# EAGLE design sparkfun-battery-babysitter (EAGLE 7.7.0)
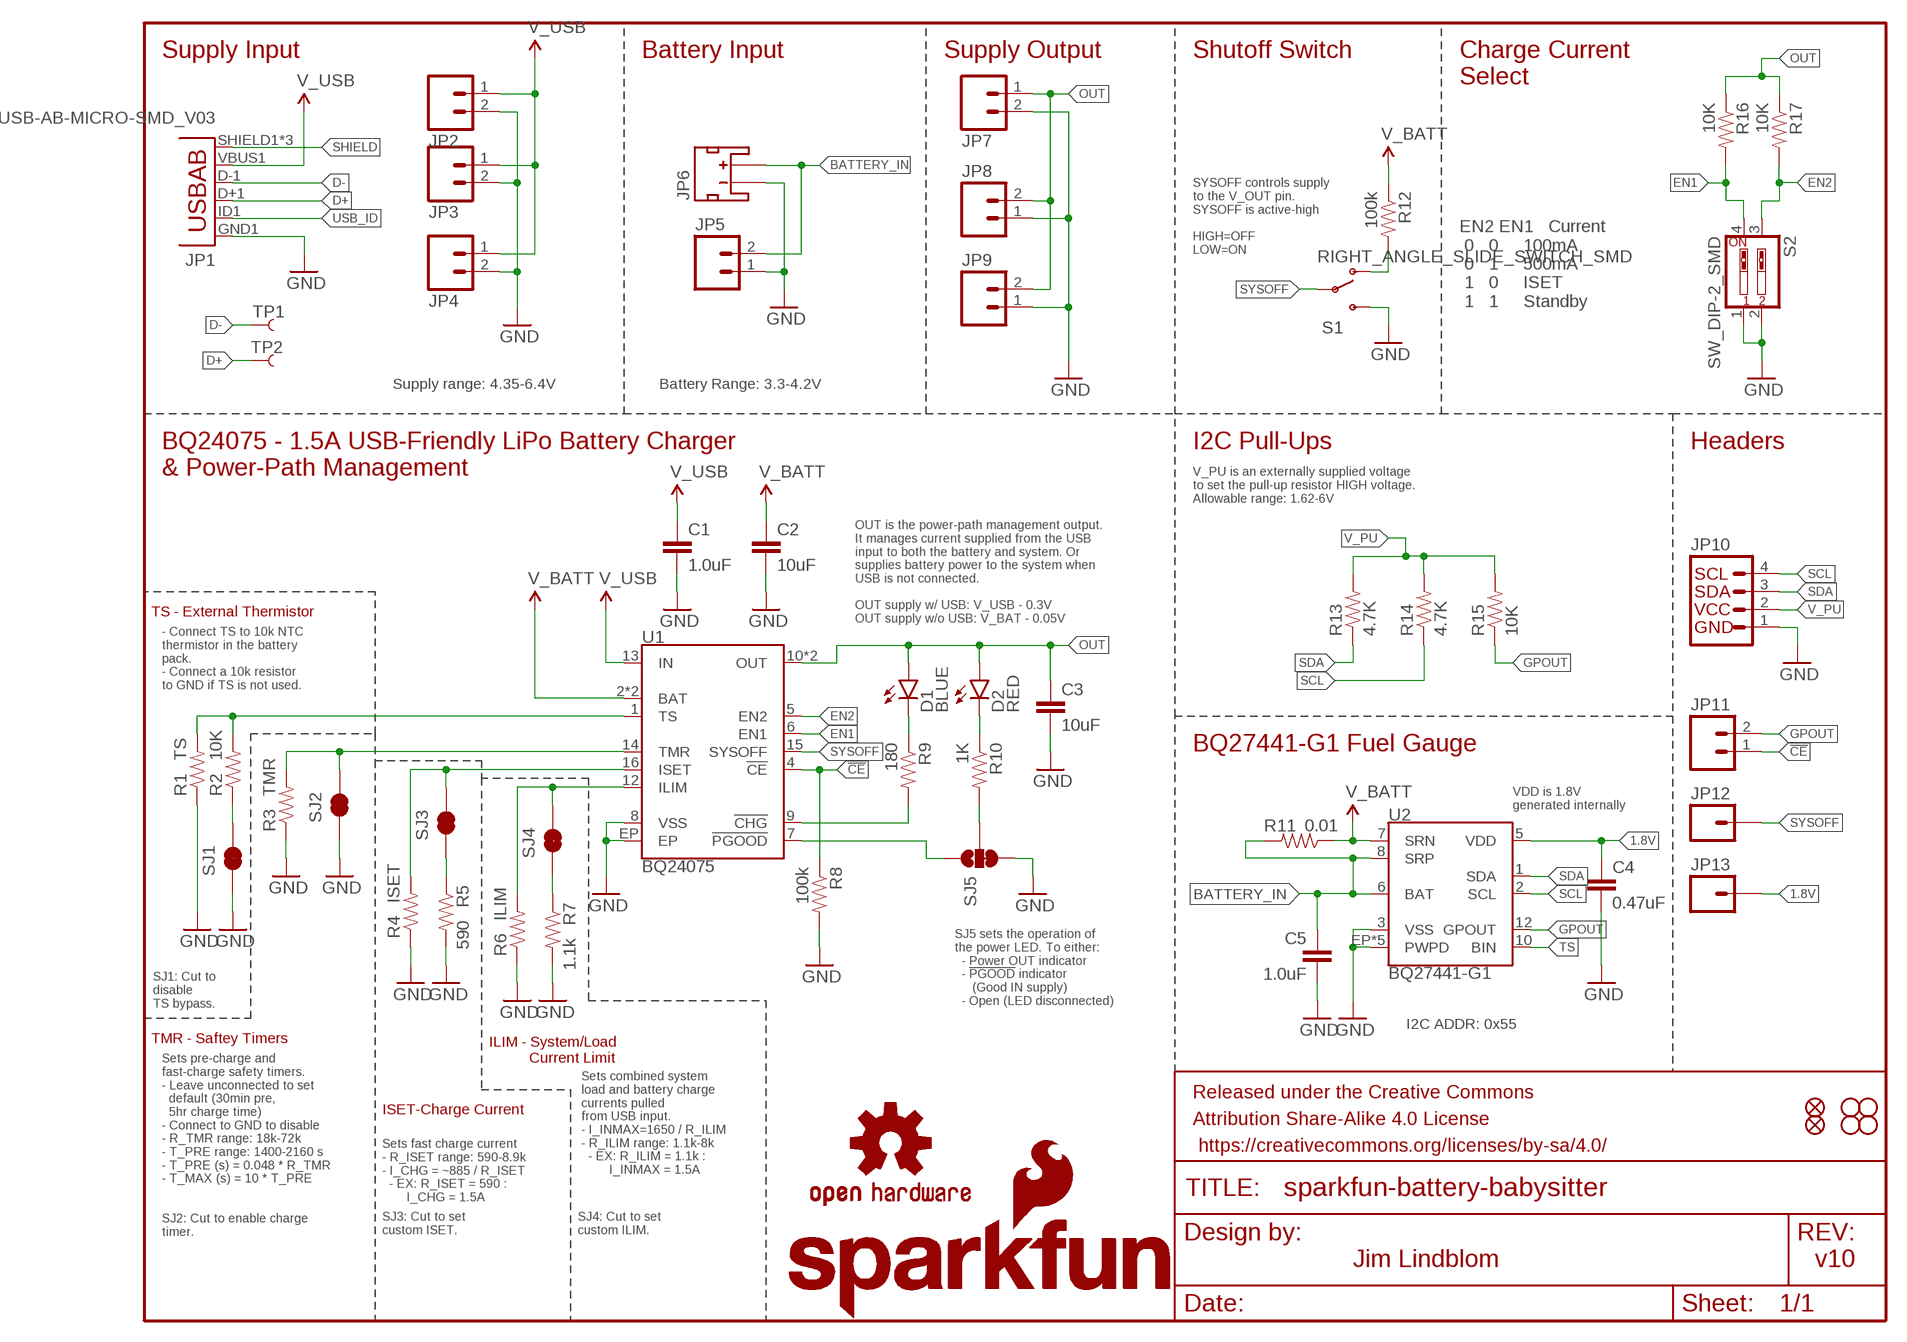
[diagram p0: schematic, sheet 1]

## Parts
C1  1.0uF  1.0UF50V10%(1206)  [1206-CAP]
C2  10uF  10UF10V10%(0805)  [0805-CAP]
C3  10uF  10UF10V10%(0805)  [0805-CAP]
C4  0.47uF  CAP0603-CAP  [0603-CAP]
C5  1.0uF  1.0UF-16V-10%(0603)  [0603-CAP]
D1  BLUE  LED-BLUE0603  [LED-0603]
D2  RED  LED-RED0603  [LED-0603]
FID1  FIDUCIAL1X2  [FIDUCIAL-1X2]
FID2  FIDUCIAL1X2  [FIDUCIAL-1X2]
FRAME1  FRAME-LETTER  [CREATIVE_COMMONS]
JP1  USB-AB-MICRO-SMD_V03  USB-ABCONN-11794  [USB-AB-MICRO-SMD_V03]
JP2  M021X02_NO_SILK  [1X02_NO_SILK]
JP3  M023.5MM-NO_SILK  [SCREWTERMINAL-3.5MM-2-NS]
JP4  M021X02_NO_SILK  [1X02_NO_SILK]
JP5  M021X02_NO_SILK  [1X02_NO_SILK]
JP6  JST_2MM_MALE  [JST-2-SMD]
JP7  M023.5MM-NO_SILK  [SCREWTERMINAL-3.5MM-2-NS]
JP8  M021X02_NO_SILK  [1X02_NO_SILK]
JP9  M02-JST-2-PTH-NO_SILK  [JST-2-PTH-NS]
JP10  I2C_STANDARD_NO_SILK  [1X04_NO_SILK]
JP11  M021X02_NO_SILK  [1X02_NO_SILK]
JP12  M01PTH_NO_SILK_YES_STOP  [1X01_NO_SILK]
JP13  M01PTH_NO_SILK_YES_STOP  [1X01_NO_SILK]
LOGO1  SFE_LOGO_NAME.1_INCH  [SFE_LOGO_NAME_.1]
LOGO2  SFE_LOGO_NAME_FLAME.1_INCH  [SFE_LOGO_NAME_FLAME_.1]
LOGO3  OSHW-LOGOS  [OSHW-LOGO-S]
R1  TS  RESISTORPTH-1/6W  [1/6W-RES]
R2  10K  10KOHM-1/10W-1%(0603)0603  [0603-RES]
R3  TMR  RESISTORPTH-1/6W  [1/6W-RES]
R4  ISET  RESISTORPTH-1/6W  [1/6W-RES]
R5  590  RESISTOR0603-RES  [0603-RES]
R6  ILIM  RESISTORPTH-1/6W  [1/6W-RES]
R7  1.1k  RESISTOR0603-RES  [0603-RES]
R8  100k  100KOHM-1/10W-1%(0603)  [0603-RES]
R9  180  180OHM1/10W1%(0603)  [0603-RES]
R10  1K  1KOHM-1/10W-1%(0603)  [0603-RES]
R11  0.01  RESISTOR1206  [1206]
R12  100k  100KOHM-1/10W-1%(0603)  [0603-RES]
R13  4.7K  4.7KOHM-1/10W-1%(0603)  [0603-RES]
R14  4.7K  4.7KOHM-1/10W-1%(0603)  [0603-RES]
R15  10K  10KOHM-1/10W-1%(0603)0603  [0603-RES]
R16  10K  10KOHM-1/10W-1%(0603)0603  [0603-RES]
R17  10K  10KOHM-1/10W-1%(0603)0603  [0603-RES]
S1  RIGHT_ANGLE_SLIDE_SWITCH_SMD  SWITCH-SPDT-SMD-A  [SWITCH-SPST-SMD-A]
S2  SW_DIP-2_SMD  SW_DIP-2-SMT-HALFSIZE  [DIPSWITCH-02-50MIL]
SJ1  JUMPER-PAD-2-NC_BY_TRACE  [PAD-JUMPER-2-NC_BY_TRACE_YES_SILK]
SJ2  JUMPER-PAD-2-NC_BY_TRACE  [PAD-JUMPER-2-NC_BY_TRACE_YES_SILK]
SJ3  JUMPER-PAD-2-NC_BY_TRACE  [PAD-JUMPER-2-NC_BY_TRACE_YES_SILK]
SJ4  JUMPER-PAD-2-NC_BY_TRACE  [PAD-JUMPER-2-NC_BY_TRACE_YES_SILK]
SJ5  JUMPER-PAD-3-2OF3_NC_BY_TRACE_SMALL  [PAD-JUMPER-3-2OF3_NC_BY_TRACE_YES_SILK_FULL_BOX]
STANDOFF1  STAND-OFF  [STAND-OFF]
STANDOFF2  STAND-OFF  [STAND-OFF]
STANDOFF3  STAND-OFF  [STAND-OFF]
STANDOFF4  STAND-OFF  [STAND-OFF]
TP1  TEST-POINT3X4  [PAD.03X.04]
TP2  TEST-POINT3X4  [PAD.03X.04]
U1  BQ24075  [PVQFN-N16]
U2  BQ27441-G1  [PDSO-N12]

## Nets
1.8V: C4.1 JP13.1 U2.5(VDD)
!CE!: JP11.1 R8.1 U1.4(!CE!)
!CHG!: R9.2 U1.9(!CHG!)
!PGOOD!: SJ5.1 U1.7(!PGOOD!)
BATTERY_IN: C5.1 JP5.2 JP6.2(+) R11.2 U2.6(BAT) U2.8(SRP)
D+: JP1.D+1(D+) TP2.P$1
D-: JP1.D-1(D-) TP1.P$1
EN1: R16.2 S2.4 U1.6(EN1)
EN2: R17.2 S2.3 U1.5(EN2)
GND: C1.2 C2.2 C3.2 C4.2 C5.2 JP1.GND1(GND) JP2.2 JP3.2 JP4.2 JP5.1 JP6.1(-) JP7.2 JP8.1 JP9.1 JP10.1 R1.1 R3.1 R4.1 R5.2 R6.1 R7.2 R8.2 S1.3(S) S2.1 S2.2 SJ1.1 SJ2.1 SJ5.3 U1.8(VSS) U1.EP U2.3(VSS) U2.EP1(PWPD) U2.EP2(PWPD) U2.EP3(PWPD) U2.EP4(PWPD) U2.EP(PWPD)
GPOUT: JP11.2 R15.1 U2.12(GPOUT)
ILIM: R6.2 SJ4.2 U1.12(ILIM)
ISET: R4.2 SJ3.2 U1.16(ISET)
N$1: R2.1 SJ1.2
N$2: R7.1 SJ4.1
N$3: R5.1 SJ3.1
N$4: R12.2 S1.1(O)
N$5: R10.2 SJ5.2
N$11: D1.C R9.1
N$12: D2.C R10.1
OUT: C3.1 D1.A D2.A JP7.1 JP8.2 JP9.2 R16.1 R17.1 U1.10(OUT) U1.11(OUT)
SCL: JP10.4 R14.1 U2.2(SCL)
SDA: JP10.3 R13.1 U2.1(SDA)
SHIELD: JP1.SHIELD1(SHIELD) JP1.SHIELD2(SHIELD) JP1.SHIELD3(SHIELD)
SYSOFF: JP12.1 S1.2(P) U1.15(SYSOFF)
TMR: R3.2 SJ2.2 U1.14(TMR)
TS: R1.2 R2.2 U1.1(TS) U2.10(BIN)
USB_ID: JP1.ID1(USBID)
V_BATT: C2.1 R11.1 R12.1 U1.2(BAT) U1.3(BAT) U2.7(SRN)
V_PU: JP10.2 R13.2 R14.2 R15.2
V_USB: C1.1 JP1.VBUS1(VBUS) JP2.1 JP3.1 JP4.1 U1.13(IN)
Unconnected: JP6.NC1(PAD1) JP6.NC2(PAD2)

## Notes on the sheet
- Supply Input | Battery Input | Supply Output | Shutoff Switch
- Charge Current
  Select
- SYSOFF controls supply 
  to the V_OUT pin.
  SYSOFF is active-high
  
  HIGH=OFF
  LOW=ON
- EN2 EN1   Current
   0   0     100mA
   0   1     500mA
   1   0     ISET
   1   1     Standby
- Supply range: 4.35-6.4V | Battery Range: 3.3-4.2V
- BQ24075 - 1.5A USB-Friendly LiPo Battery Charger 
  & Power-Path Management
- I2C Pull-Ups | Headers
- V_PU is an externally supplied voltage 
  to set the pull-up resistor HIGH voltage.
  Allowable range: 1.62-6V
- OUT is the power-path management output.
  It manages current supplied from the USB 
  input to both the battery and system. Or
  supplies battery power to the system when 
  USB is not connected.
  
  OUT supply w/ USB: V_USB - 0.3V
  OUT supply w/o USB: V_BAT - 0.05V
- TS - External Thermistor
- - Connect TS to 10k NTC 
  thermistor in the battery
  pack.
  - Connect a 10k resistor 
  to GND if TS is not used.
- BQ27441-G1 Fuel Gauge
- VDD is 1.8V
  generated internally
- SJ5 sets the operation of 
  the power LED. To either:
    - Power OUT indicator
    - !PGOOD! indicator 
       (Good IN supply)
    - Open (LED disconnected)
- SJ1: Cut to 
  disable
  TS bypass.
- I2C ADDR: 0x55
- TMR - Saftey Timers
- ILIM - System/Load 
            Current Limit
- Sets pre-charge and
  fast-charge safety timers.
  - Leave unconnected to set
    default (30min pre, 
    5hr charge time)
  - Connect to GND to disable
  - R_TMR range: 18k-72k
  - T_PRE range: 1400-2160 s
  - T_PRE (s) = 0.048 * R_TMR
  - T_MAX (s) = 10 * T_PRE
- Sets combined system
  load and battery charge 
  currents pulled
  from USB input.
  - I_INMAX=1650 / R_ILIM
  - R_ILIM range: 1.1k-8k
    - EX: R_ILIM = 1.1k : 
          I_INMAX = 1.5A
- ISET-Charge Current
- Sets fast charge current
  - R_ISET range: 590-8.9k
  - I_CHG = ~885 / R_ISET
    - EX: R_ISET = 590 : 
         I_CHG = 1.5A
- SJ3: Cut to set
  custom ISET.
- SJ4: Cut to set
  custom ILIM.
- SJ2: Cut to enable charge
  timer.
- Jim Lindblom | v10

## Library data of the parts
C1 = SparkFun-Capacitors:1.0UF50V10%(1206): CAP-09822; PROD_ID: CAP-09822
C2 C3 = SparkFun-Capacitors:10UF10V10%(0805): CAP-11330; PROD_ID: CAP-11330
C4 = SparkFun-Capacitors:CAP: Capacitor Standard 0603 ceramic capacitor, and 0.1" leaded capacitor.; PROD_ID: CAP-13216
C5 = SparkFun-Capacitors:1.0UF-16V-10%(0603): CAP-00868; PROD_ID: CAP-00868
D1 = SparkFun-LED:LED-BLUE: Blue LEDs for production use Various blue LEDs stocked by SparkFun production 0603 - DIO-08575 Rebel - DIO-09553 1206 - DIO-09911; PROD_ID: DIO-08575
D2 = SparkFun-LED:LED-RED: Assorted Red LEDs LilyPad 1206- DIO-09912 1206- DIO-00809 0603- DIO-00819 "SMART" means more efficient and expensive; PROD_ID: DIO-00819
FID1 FID2 = SparkFun-Aesthetics:FIDUCIAL: Fiducial Alignment Points Various fiducial points for machine vision alignment.
FRAME1 = SparkFun-Aesthetics:FRAME-LETTER: Schematic Frame Standard 8.5x11 US Letter frame
JP1 = SparkFun-Connectors:USB-AB: This is a USB AB connector that is compatible with USB OTG. i.e. this connector can serve as a host or device; PROD_ID: CONN-11794
JP2 JP4 JP5 JP8 JP9 JP11 = SparkFun-Connectors:M02: Standard 2-pin 0.1" header. Use with - straight break away headers ( PRT-00116) - right angle break away headers (PRT-00553) - swiss pins (PRT-00743) - machine pins (PRT-00117) - female headers (PRT-00115) Molex polarized connector foot print use with: PRT-08233 with associated crimp pins and housings. 2.54_SCREWTERM for use with PRT-10571. 3.5mm Screw Terminal footprints for PRT-08084 5mm Screw Terminal footprints for use with PRT-08432
JP3 JP7 = SparkFun-Connectors:M02: Standard 2-pin 0.1" header. Use with - straight break away headers ( PRT-00116) - right angle break away headers (PRT-00553) - swiss pins (PRT-00743) - machine pins (PRT-00117) - female headers (PRT-00115) Molex polarized connector foot print use with: PRT-08233 with associated crimp pins and housings. 2.54_SCREWTERM for use with PRT-10571. 3.5mm Screw Terminal footprints for PRT-08084 5mm Screw Terminal footprints for use with PRT-08432; PROD_ID: CONN-08399
JP6 = SparkFun-Connectors:JST_2MM_MALE: Mates to single-cell LiPo batteries. CONN-11443 Now with smashable polarity marks!; BTM_NEG: -; BTM_POS: +; PROD_ID: CONN-11443; TOP_NEG: -; TOP_POS: +
JP10 = SparkFun-Connectors:I2C_STANDARD: SparkFun has standardized on a pinout for all I2C based sensor breakouts. This pinout allows I2C boards to be plugged directly into the headers on Arduino Uno compatible boards, and to be daisy chained easily.
JP12 JP13 = SparkFun-Connectors:M01: Header 1 Standard 1-pin 0.1" header. Use with straight break away headers (SKU : PRT-00116), right angle break away headers (PRT-00553), swiss pins (PRT-00743), machine pins (PRT-00117), and female headers (PRT-00115). SMTSO-256-ET is a "flush mount" nut for a 4-40 screw. The older package used to be too tight, and did not allow it to sit properly thru the drill hit. The latest (0.165DIA) fits nice and snug.
LOGO1 = SparkFun-Aesthetics:SFE_LOGO_NAME: SFE Logo, name only This is the SparkFun name logo. The logo on the schematic will always be the same size; the package variant is the height of the flame part of the logo (or the height the flame would be, if it were drawn). Default layer for the logo on the board is tSilk.
LOGO2 = SparkFun-Aesthetics:SFE_LOGO_NAME_FLAME: SFE Logo, name and flame This is the SparkFun full logo. The logo on the schematic will always be the same size; the package variant is the height of the flame part of the logo. Default layer for the logo on the board is tSilk.
LOGO3 = SparkFun-Aesthetics:OSHW-LOGO: Open Source Hardware Logo This logo indicates the piece of hardware it is found on incorporates a OSHW license and/or adheres to the definition of open source hardware found here: http://freedomdefined.org/OSHW
R1 R3 R4 R6 = SparkFun-Resistors:RESISTOR: Resistor Basic schematic elements and footprints for 0603, 1206, and PTH resistors.
R2 R15-R17 = SparkFun-Resistors:10KOHM-1/10W-1%(0603): RES-00824; PROD_ID: RES-00824
R5 = SparkFun-Passives:RESISTOR: Resistor Basic schematic elements and footprints for 0603, 1206, and PTH resistors.; PROD_ID: RES-13217
R7 = SparkFun-Passives:RESISTOR: Resistor Basic schematic elements and footprints for 0603, 1206, and PTH resistors.; PROD_ID: RES-10447
R8 R12 = SparkFun-Resistors:100KOHM-1/10W-1%(0603): RES-07828; PROD_ID: RES-07828
R9 = SparkFun-Resistors:180OHM1/10W1%(0603): RES-08788; PROD_ID: RES-08788
R10 = SparkFun-Resistors:1KOHM-1/10W-1%(0603): RES-07856; PROD_ID: RES-07856
R11 = SparkFun-Resistors:RESISTOR: Resistor Basic schematic elements and footprints for 0603, 1206, and PTH resistors.; PROD_ID: RES-13218
R13 R14 = SparkFun-Resistors:4.7KOHM-1/10W-1%(0603): RES-07857; PROD_ID: RES-07857
S1 = SparkFun-Electromechanical:SWITCH-SPDT: SPDT Switch Simple slide switch, Spark Fun Electronics SKU : COM-00102 DPDT SMT slide switch, AYZ0202, SWCH-08179; PROD_ID: SWCH-10651
S2 = SparkFun-Electromechanical:SW_DIP-2: DIP SWITCH; PROD_ID: SWCH-13215
SJ1-SJ4 = SparkFun-Passives:JUMPER-PAD-2-NC_BY_TRACE
SJ5 = SparkFun-Passives:JUMPER-PAD-3-2OF3_NC_BY_TRACE
STANDOFF1-STANDOFF4 = SparkFun-Electromechanical:STAND-OFF: #4 Stand Off This is the mechanical footprint for a #4 phillips button head screw. Use the keepout ring to avoid running the screw head into surrounding components. SKU : PRT-00447
TP1 TP2 = SparkFun-Passives:TEST-POINT: Bare copper test points for troubleshooting or ICT
U1 = SparkFun-PowerIC:BQ24075: Texas Instruments BQ24075 LiPo Battery Chargerand Power-Path Management IC The bq2407x series of devices are integrated Li-Ion linear chargers and system power path management devices targeted at space-limited portable applications. The devices operate from either a USB port or an AC adapter and support charge currents up to 1.5 A. The input voltage range with input overvoltage protection supports unregulated adapters. The USB input current limit accuracy and start up sequence allow the bq2407x to meet USB-IF inrush current specifications. Additionally, the input dynamic power management (VIN-DPM) prevents the charger from crashing incorrectly configured USB sources. Datasheet <http://www.ti.com/product/BQ24075/datasheet> SparkFun Products SparkFun Battery Babysitter <https://www.sparkfun.com/products/13777> (PRT-13777); PROD_ID: IC-13219
U2 = SparkFun-PowerIC:BQ27441-G1: Texas Instruments BQ27441-G1 LiPo Battery Fuel Gauge The Texas Instruments bq27441-G1 fuel gauge is a microcontroller peripheral that provides system-side fuel gauging for single-cell Li-Ion batteries. The device requires minimal user configuration and system microcontroller firmware development. The bq27441-G1 battery fuel gauge uses the patented Impedance Track™ algorithm for fuel gauging, and provides information such as remaining battery capacity (mAh), state-of-charge (%), and battery voltage (mV). Datasheet <http://www.ti.com/product/BQ27441-G1/datasheet> SparkFun Products SparkFun Battery Babysitter <https://www.sparkfun.com/products/13777> (PRT-13777); PROD_ID: IC-13220

## Board
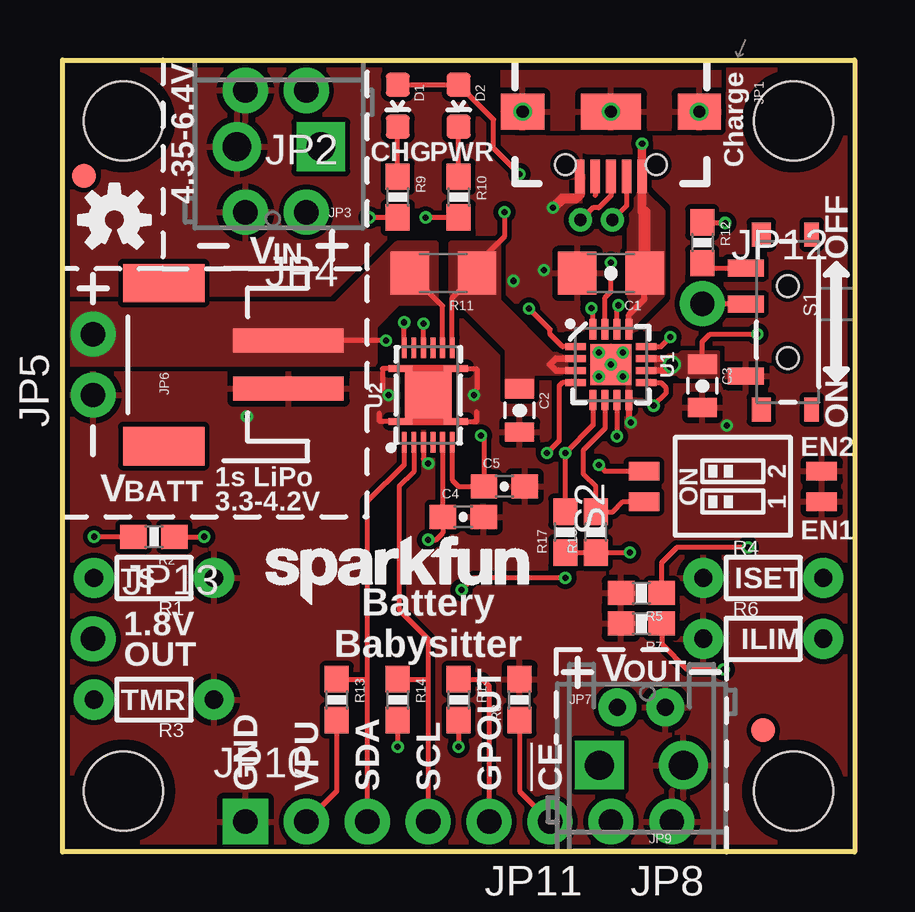
[diagram p1: board, top side]
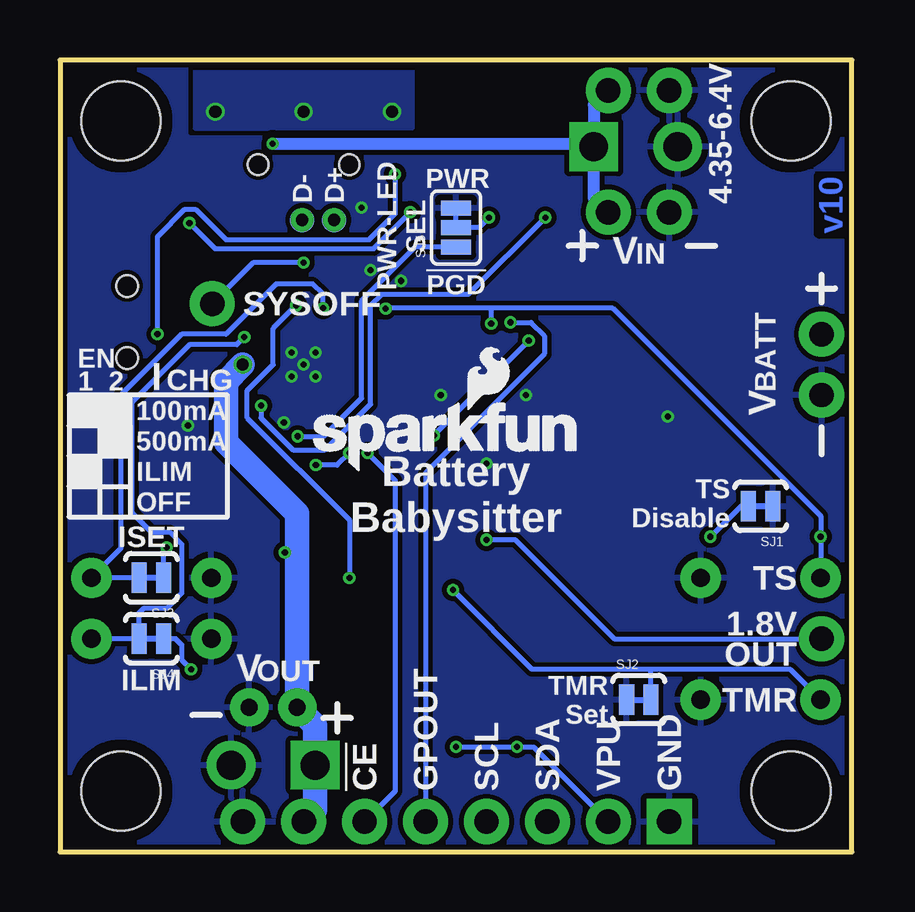
[diagram p2: board, bottom side, seen from below]

Size 33.02 x 33.02 mm. Coordinates in mm from the lower left corner, seen from the top.
Outline: 0,33.02 33.02,33.02 33.02,0 0,0 0,33.02
Copper layers (1*16): Top 0.035mm / dielectric 1.5mm / Bottom 0.035mm
Design rules "SparkFun-2-layer-FAB-LIMIT *": minimum track width 7mil, minimum drill 6mil, track to track 7mil, track to pad 7mil, pad to pad 7mil, via to via 7mil, smd to smd 7mil, copper to edge 7mil, drill to drill 7mil, minimum pad ring 5mil, minimum via ring 5mil, stop-mask expansion 4mil, vias tented up to drill 20mil, thermal gap 10mil

### Footprints (pad centres in the part's own frame; a part is rotated, then mirrored left to right if it is on the bottom)
1206-CAP = smd 1.6 x 1.8: 1 -1.4,0; 2 1.4,0
0805-CAP = smd 0.8 x 1.2: 1 -0.9,0; 2 0.9,0
0603-CAP = smd 1.1 x 1: 1 -0.85,0; 2 0.85,0
LED-0603 = smd 1 x 1: A 0,-0.877; C 0,0.877
FIDUCIAL-1X2 = smd 1 x 1: 1 0,0
USB-AB-MICRO-SMD_V03 = smd 1.4 x 0.4: D+1 2.7,0; D-1 2.7,0.65; GND1 2.7,-1.3; ID1 2.7,-0.65; VBUS1 2.7,1.3 | smd 1.5 x 1.8: SHIELD1 0,3.68; SHIELD3 0,-3.68 | smd 1.5 x 2.5: SHIELD2 0,0 | hole 0.85: 2.2,1.9; 2.2,-1.9
1X02_NO_SILK = drill 1.016 pad 1.88: 1 0,0; 2 2.54,0
SCREWTERMINAL-3.5MM-2-NS = drill 1.2 pad 2.032 square: 1 0,0 | drill 1.2 pad 2.032: 2 3.5,0
JST-2-SMD = smd 1 x 4.6: 1 -1,-3.7; 2 1,-3.7 | smd 1.6 x 3.4: NC1 -3.4,1.5; NC2 3.4,1.5
JST-2-PTH-NS = drill 0.7 pad 1.6: 1 -1,0; 2 1,0
1X04_NO_SILK = drill 1.016 pad 1.88 square: 1 0,0 | drill 1.016 pad 1.88: 2 2.54,0; 3 5.08,0; 4 7.62,0
1X01_NO_SILK = drill 1.016 pad 1.88: 1 0,0
1/6W-RES = drill 0.762 pad 1.676: 1 -2.5,0; 2 2.5,0
0603-RES = smd 1.1 x 1: 1 -0.85,0; 2 0.85,0
1206 = smd 1.6 x 1.8: 1 -1.4,0; 2 1.4,0
SWITCH-SPST-SMD-A = smd 0.7 x 1.5: 1 -2.25,-1.75; 2 -0.75,-1.75; 3 2.25,-1.75 | smd 1 x 0.6: GND1 -3.65,1; GND3 3.65,1 | smd 1 x 0.8: GND2 -3.65,-1.1; GND4 3.65,-1.1 | hole 0.9: -1.5,0; 1.5,0
DIPSWITCH-02-50MIL = smd 0.762 x 1.27: 1 -0.635,-3.7; 2 0.635,-3.7; 3 0.635,3.7; 4 -0.635,3.7
PAD-JUMPER-2-NC_BY_TRACE_YES_SILK = smd 0.635 x 1.27: 1 -0.508,0; 2 0.508,0
PAD-JUMPER-3-2OF3_NC_BY_TRACE_YES_SILK_FULL_BOX = smd 0.635 x 1.27: 1 -0.813,0; 2 0,0; 3 0.813,0
STAND-OFF = hole 3.302: 0,0
PAD.03X.04 = smd 1.016 x 1.016: P$1 0,0
PVQFN-N16 = smd 0.28 x 0.85: 1 -0.75,-1.475; 2 -0.25,-1.475; 3 0.25,-1.475; 4 0.75,-1.475; 9 0.75,1.475; 10 0.25,1.475; 11 -0.25,1.475; 12 -0.75,1.475 | smd 0.85 x 0.28: 5 1.475,-0.75; 6 1.475,-0.25; 7 1.475,0.25; 8 1.475,0.75; 13 -1.475,0.75; 14 -1.475,0.25; 15 -1.475,-0.25; 16 -1.475,-0.75 | smd 1.7 x 1.7: EP 0,0
PDSO-N12 = smd 0.2 x 0.85: 1 -1,-1.975; 2 -0.6,-1.975; 3 -0.2,-1.975; 4 0.2,-1.975; 5 0.6,-1.975; 6 1,-1.975; 7 1,1.975; 8 0.6,1.975; 9 0.2,1.975; 10 -0.2,1.975; 11 -0.6,1.975; 12 -1,1.975 | smd 1.95 x 1.95: EP 0,0 | smd 1 x 0.25: EP1 -1.15,1.1; EP2 -1.15,-1.1; EP3 1.15,-1.1; EP4 1.15,1.1

### Placement (x,y rotation side)
C1  22.86,24.13 180 top
C2  19.05,18.41 270 top
C3  26.67,19.43 270 top
C4  16.7,13.97 0 top
C5  18.41,15.24 0 top
D1  13.97,31.11 180 top
D2  16.51,31.11 180 top
FID1  0.89,28.19 0 top
FID2  29.21,5.08 0 top
FRAME1  -0.64,-20.95 0 top  (outside the outline)
JP1  22.86,30.86 270 top
JP2  10.16,31.75 180 top
JP3  10.77,29.4 180 top
JP4  10.16,26.67 180 top
JP5  1.27,19.05 90 top
JP6  5.71,20.32 90 top
JP7  22.38,3.62 0 top
JP8  25.4,1.27 180 top
JP9  24.13,6.03 180 top
JP10  7.62,1.27 0 top
JP11  20.32,1.27 180 top
JP12  26.67,22.86 0 top
JP13  1.27,8.89 0 top
LOGO1  8,9.84 0 top
LOGO2  22.86,15.81 0 bottom
LOGO3  2.16,26.35 0 top
R1  3.81,11.43 180 top
R2  3.81,13.14 180 top
R3  3.81,6.35 180 top
R4  29.21,11.43 0 top
R5  24.13,10.79 180 top
R6  29.21,8.89 0 top
R7  24.13,9.53 180 top
R8  19.05,6.35 90 top
R9  13.97,27.3 270 top
R10  16.51,27.3 270 top
R11  15.88,24.13 180 top
R12  26.67,25.4 270 top
R13  11.43,6.35 270 top
R14  13.97,6.35 270 top
R15  16.51,6.35 270 top
R16  22.23,13.34 90 top
R17  20.95,13.34 90 top
S1  30.23,22.1 270 top
S2  27.94,15.24 90 top
SJ1  3.81,14.41 180 bottom
SJ2  8.89,6.35 0 bottom
SJ3  29.21,11.43 180 bottom
SJ4  29.21,8.89 180 bottom
SJ5  16.51,26.04 90 bottom
STANDOFF1  30.48,30.48 0 top
STANDOFF2  2.54,2.54 0 top
STANDOFF3  2.54,30.48 0 top
STANDOFF4  30.48,2.54 0 top
TP1  22.92,26.35 0 bottom
TP2  21.59,26.35 0 bottom
U1  22.86,20.32 270 top
U2  15.24,19.05 0 top

### Tracks (layer width: path | path; a pad name or v marks a point on that pad's centre or on a via)
1.8V  (via drill 0.25)
  Top 0.203: U2.5 C4.1 15.85,13.31 15.56,13.02 v15.24,13.02
  Bottom 0.203: JP13.1 9.91,8.89 14.03,13.02 v15.24,13.02
!CE!  (via drill 0.25)
  Top 0.203: U1.4 20.84,19.57 20.7,19.43 20.7,17.14 v20.19,16.64 | R8.1 19.05,2.54 JP11.1
  Bottom 0.203: v20.19,16.64 19.05,15.49 19.05,2.54 JP11.1
!CHG!  (via drill 0.25)
  Top 0.203: U1.9 24.94,19.57 25.15,19.37 25.15,19.11 v24.64,18.61 | R9.2 v12.79,26.45
  Bottom 0.203: v24.64,18.61 24.64,18.1 23.3,16.76 21.97,16.76 20.07,18.67 20.07,22.8 19.62,23.24 16,23.24 v12.79,26.45
!PGOOD!  (via drill 0.25)
  Top 0.203: U1.7 v23.11,17.33
  Bottom 0.203: v23.11,17.33 22.04,17.33 20.45,18.92 20.45,22.99 18.21,25.22 SJ5.1
BATTERY_IN  (via drill 0.25)
  Top 0.203: U2.8 15.84,22.77 R11.2 | U2.6 16.24,15.51 16.51,15.24 C5.1 17.57,17.23 v17.44,17.36 | v13.48,21.32 JP6.2
  Bottom 0.203: v13.48,21.32 v17.44,17.36
  pour Top (isolate 0.203, no thermals): 0,22.86 11.43,22.86 13.97,25.4 15.56,25.4 15.56,22.86 13.97,22.86 13.02,21.91 13.02,20.32 0,20.32
D+  (via drill 0.51 pad 0.97)
  Top 0.203: JP1.D+1 22.86,27.37 22.35,26.86 22.1,26.86 TP2.P$1
  other vias: 21.59,26.35
D-  (via drill 0.51 pad 0.97)
  Top 0.203: JP1.D-1 23.51,26.94 TP1.P$1
  other vias: 22.92,26.35
EN1
  Top 0.203: U1.6 22.61,17.66 21.72,16.76 21.72,15.75 22.23,15.24 R16.2 22.95,14.19 23.37,14.61 S2.4
EN2  (via drill 0.25)
  Top 0.203: U1.5 22.11,17.79 v20.95,16.64 R17.2 | v22.35,16.13 22.61,15.88 S2.3
  Bottom 0.203: v20.95,16.64 21.46,16.13 v22.35,16.13
GND  (via drill 0.25)
  Top 0.203: U2.EP1 13.34,20.15 13.34,19.3 | U2.EP4 17.27,20.15 17.27,19.3 | U2.EP3 17.27,17.95 17.27,18.35 | U2.EP2 13.21,17.95 13.21,18.29 | U2.3 15.04,16.39 v15.24,16.19
  Top 0.254: U2.EP1 15.24,20.15 | U1.8 23.61,18.11
  Top 0.406: JP1.GND1 21.56,27.4 21.4,27.24 20.83,27.24 v20.45,26.86
  other vias: 22.86,20.32 23.36,20.82 23.36,19.82 22.36,19.82 22.36,20.82 17.14,19.05 13.59,19.05 23.69,17.91 20.07,24.26 7.68,18.16 27.69,17.78 18.8,23.81
  pour Top (isolate 0.203, rank 6): 0,33.02 0,0 33.02,0 33.02,33.02
  pour Bottom (isolate 0.203, rank 6): 0,33.02 0,0 33.02,0 33.02,33.02
GPOUT  (via drill 0.25)
  Top 0.203: U2.12 v14.24,22.08 | R15.1 17.5,7.2 17.78,6.92 JP11.2
  Bottom 0.203: v14.24,22.08 13.38,22.08 12.83,21.53 12.83,20.77 17.78,15.81 JP11.2
ILIM  (via drill 0.25)
  Top 0.203: U1.12 24.94,21.07 v25.34,21.46
  Bottom 0.203: v25.34,21.46 25.65,21.14 27.62,21.14 30.04,18.73 30.04,14.16 29.21,13.34 28.45,13.34 27.94,12.83 27.94,10.79 28.57,10.16 29.53,10.16 29.72,9.97 SJ4.2 R6.2
ISET  (via drill 0.25)
  Top 0.203: U1.16 22.11,22.61 v22.05,22.67
  Bottom 0.203: SJ3.2 R4.2 30.48,12.66 30.48,19.05 27.94,21.59 26.1,21.59 24,23.69 22.48,23.69 22.05,23.25 v22.05,22.67
N$1  (via drill 0.25)
  Top 0.203: R2.1 v5.91,13.14
  Bottom 0.203: v5.91,13.14 4.64,14.41 SJ1.2
N$2  (via drill 0.25)
  Top 0.203: R7.1 24.98,8.68 26.04,7.62 v27.56,7.62
  Bottom 0.203: SJ4.1 28.19,8.89 27.94,8.64 27.94,8 v27.56,7.62
N$3  (via drill 0.25)
  Top 0.203: v28.57,12.7 25.61,12.7 24.98,12.06 R5.1
  Bottom 0.203: SJ3.1 28.7,12.57 v28.57,12.7
N$4
  Top 0.203: 27.94,24.55 28.27,24.55 S1.1 26.87,24.35 R12.2
N$5  (via drill 0.25)
  Top 0.203: R10.2 v15.14,26.45
  Bottom 0.203: v15.14,26.45 15.56,26.04 SJ5.2
N$11
  Top 0.203: R9.1 D1.C
N$12
  Top 0.203: R10.1 D2.C
OUT  (via drill 0.25, 0.51)
  Top 0.203: R17.1 R16.1 v23.65,12.48 | C3.1 26.67,21.27 26.99,21.59 v28.96,21.59 | v19.05,28.26 17.97,29.34 17.97,30.53 D2.A D1.A
  Top 0.279: U1.11 25.15,20.57 v25.4,20.32 25.15,20.07 U1.10
  Bottom 0.203: 23.13,11.43 23.13,10.16 23.13,9.65 | v28.96,21.59 28.96,25.65 27.81,26.8 27.37,26.8 26.1,25.53 20.13,25.53 19.05,26.61 v19.05,28.26 | v23.65,12.48 23.13,12.48
  Bottom 1.016: JP8.2 22.38,1.75 JP7.1 22.38,5.28 JP9.2 23.13,10.16 23.13,12.48 23.13,14.11 26.1,17.08 26.1,19.62 v25.4,20.32
  pour Top (isolate 0.305, no thermals): 24.77,20.7 25.72,20.7 25.84,20.83 27.3,20.83 27.3,19.81 25.78,19.81 25.65,19.94 24.77,19.94
SCL
  Top 0.203: 15.24,7.2 15.24,8.89 14.03,10.1 14.03,15.24 14.64,15.85 U2.2 | 15.24,7.2 JP10.4 | R14.1 15.24,7.2
SDA
  Top 0.203: U2.1 14.24,16.14 12.7,14.61 12.7,7.2 | 12.7,7.2 JP10.3 | R13.1 12.7,7.2
SHIELD  (via drill 0.51)
  other vias: 19.18,30.86 26.54,30.86 22.86,30.86
  pour Bottom (isolate 0.305): 18.35,33.02 18.35,30.16 27.37,30.16 27.37,33.02
  pour Top (isolate 0.305): 27.37,33.02 27.37,30.16 18.35,30.16 18.35,33.02
SYSOFF  (via drill 0.25)
  Top 0.203: v22.86,24.57 22.86,23.36 22.61,23.11 U1.15 | JP12.1 28.46,22.86 S1.2
  Bottom 0.203: v22.86,24.57 24.96,24.57 JP12.1
TMR  (via drill 0.25)
  Top 0.203: v20.95,11.43 17.14,11.43 v16.64,10.92 | U1.14 23.11,22.73 v23.17,22.79
  Bottom 0.203: v23.17,22.79 24.13,21.84 24.13,20.32 25.21,19.24 25.21,18.1 20.95,13.84 v20.95,11.43 | 8.38,7.62 2.58,7.62 R3.2 | 8.38,7.62 13.34,7.62 v16.64,10.92 | SJ2.2 8.38,7.62
TS  (via drill 0.25)
  Top 0.203: U2.10 v15.04,22.02 | U1.1 20.84,21.07 20.32,21.59 20.32,21.78 v19.44,22.66 | R2.2 v1.31,13.14
  Bottom 0.203: 15.04,22.67 9.97,22.67 1.31,14.01 v1.31,13.14 R1.2 | 15.04,22.67 v19.43,22.67 v19.44,22.66 | v15.04,22.02 15.04,22.67
USB_ID
  Top 0.203: JP1.ID1 22.21,27.37
V_BATT  (via drill 0.25)
  Top 0.203: U2.7 16.24,23.09 R11.1 17.27,24.51 18.41,25.65 v18.41,26.67 | v27.62,26.23 26.7,26.23 R12.1
  Top 0.279: U1.2 20.57,20.57 20.32,20.32 20.57,20.07 U1.3
  Bottom 0.203: v27.62,26.23 26.54,25.15 19.94,25.15 v18.41,26.67
  pour Top (isolate 0.203, no thermals): 16.19,25.4 18.16,25.4 18.16,22.99 20.38,20.76 20.95,20.76 20.95,19.94 19.56,19.94 19.56,19.05 18.54,19.05 18.54,20.95 16.19,23.3
V_PU  (via drill 0.25)
  Top 0.203: R13.2 11.43,2.54 JP10.2 | R14.2 v13.97,4.38 | R15.2 v16.51,4.38
  Bottom 0.203: JP10.2 13.27,4.38 v13.97,4.38 v16.51,4.38
V_USB  (via drill 0.25)
  Top 0.254: U1.13 23.61,22.4 24.26,23.05 C1.1
  Top 0.356: 24.16,26.67 JP1.VBUS1 v24.16,29.53
  Top 0.508: 24.26,26.67 C1.1
  Bottom 0.508: v24.16,29.53 10.89,29.53 JP3.1 | JP2.1 10.77,31.14 JP3.1 | JP4.1 10.77,27.28 JP3.1
  pour Top (isolate 0.203, no thermals): 23.62,21.46 23.62,27.05 24,27.43 24.32,27.43 25.02,26.73 25.02,23.24 23.88,22.1 23.88,21.46

### Text on the board
Bottom: v10
tPlace: 4.35-6.4V | Charge | CHG | PWR | V | IN | OFF | ON | EN2 | 1s LiPo | V | BATT | 3.3-4.2V | EN1 | Battery / Babysitter | 1.8V | OUT | V | OUT | GND | VPU | SDA | SCL | GPOUT | !CE!
bPlace: 4.35-6.4V | PWR | D+ | D- | PWR-LED / SEL | IN | V | !PGD! | SYSOFF | EN | BATT | V | CHG | I | 2 | 1 | 100mA | Battery / Babysitter | 500mA | ILIM | TS / Disable | OFF | ISET | TS | 1.8V | OUT | ILIM | OUT | V | TMR | TMR / Set | GND | VPU | SDA | SCL | GPOUT | !CE!
Measures: Units in inches
tDocu: Jim Lindblom